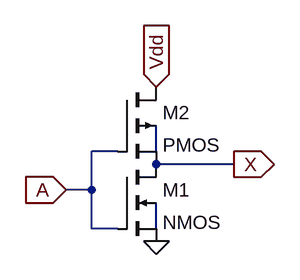
[diagram p0: schematic not_gate.asc]
not_gate.asc, the LTspice schematic file:
Version 4.1
SHEET 1 880 680
WIRE 112 96 80 96
WIRE 160 96 160 64
WIRE 256 112 160 112
WIRE 80 144 80 96
WIRE 80 144 48 144
WIRE 80 192 80 144
WIRE 112 192 80 192
WIRE 160 192 160 160
FLAG 160 16 Vdd
IOPIN 160 16 In
FLAG 48 144 A
IOPIN 48 144 In
FLAG 160 208 0
FLAG 256 112 X
IOPIN 256 112 Out
SYMBOL nmos4 112 112 R0
SYMATTR InstName M1
SYMBOL pmos4 112 16 R0
SYMATTR InstName M2

The netlist it stands for:
* not_gate.asc
M1 X A 0 N002 NMOS
M2 Vdd A X N001 PMOS
.model NMOS NMOS
.model PMOS PMOS
.lib standard.mos
.backanno
.end